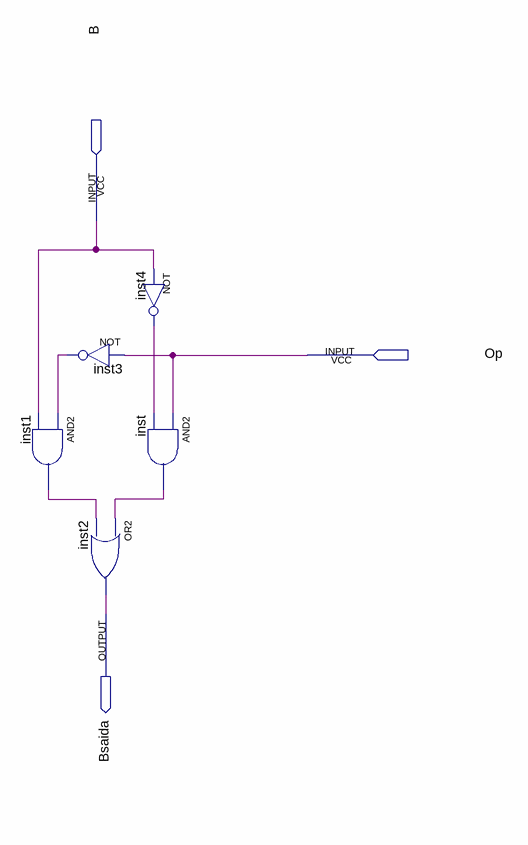
[diagram p0: schematic sheet]
// Quartus schematic MUX21.bdf as structural Verilog: 5 symbols, 3 pins
module MUX21 (
  input  B,
  input  Op,
  output Bsaida
);

  wire inst1_out, inst3_out, inst4_out, inst_out;

  not inst3 (inst3_out, Op);
  and inst1 (inst1_out, inst3_out, B);
  or inst2 (Bsaida, inst_out, inst1_out);
  not inst4 (inst4_out, B);
  and inst (inst_out, Op, inst4_out);
endmodule
